# Altium schematic sheet 10.SchDoc
size 513 x 386 mm
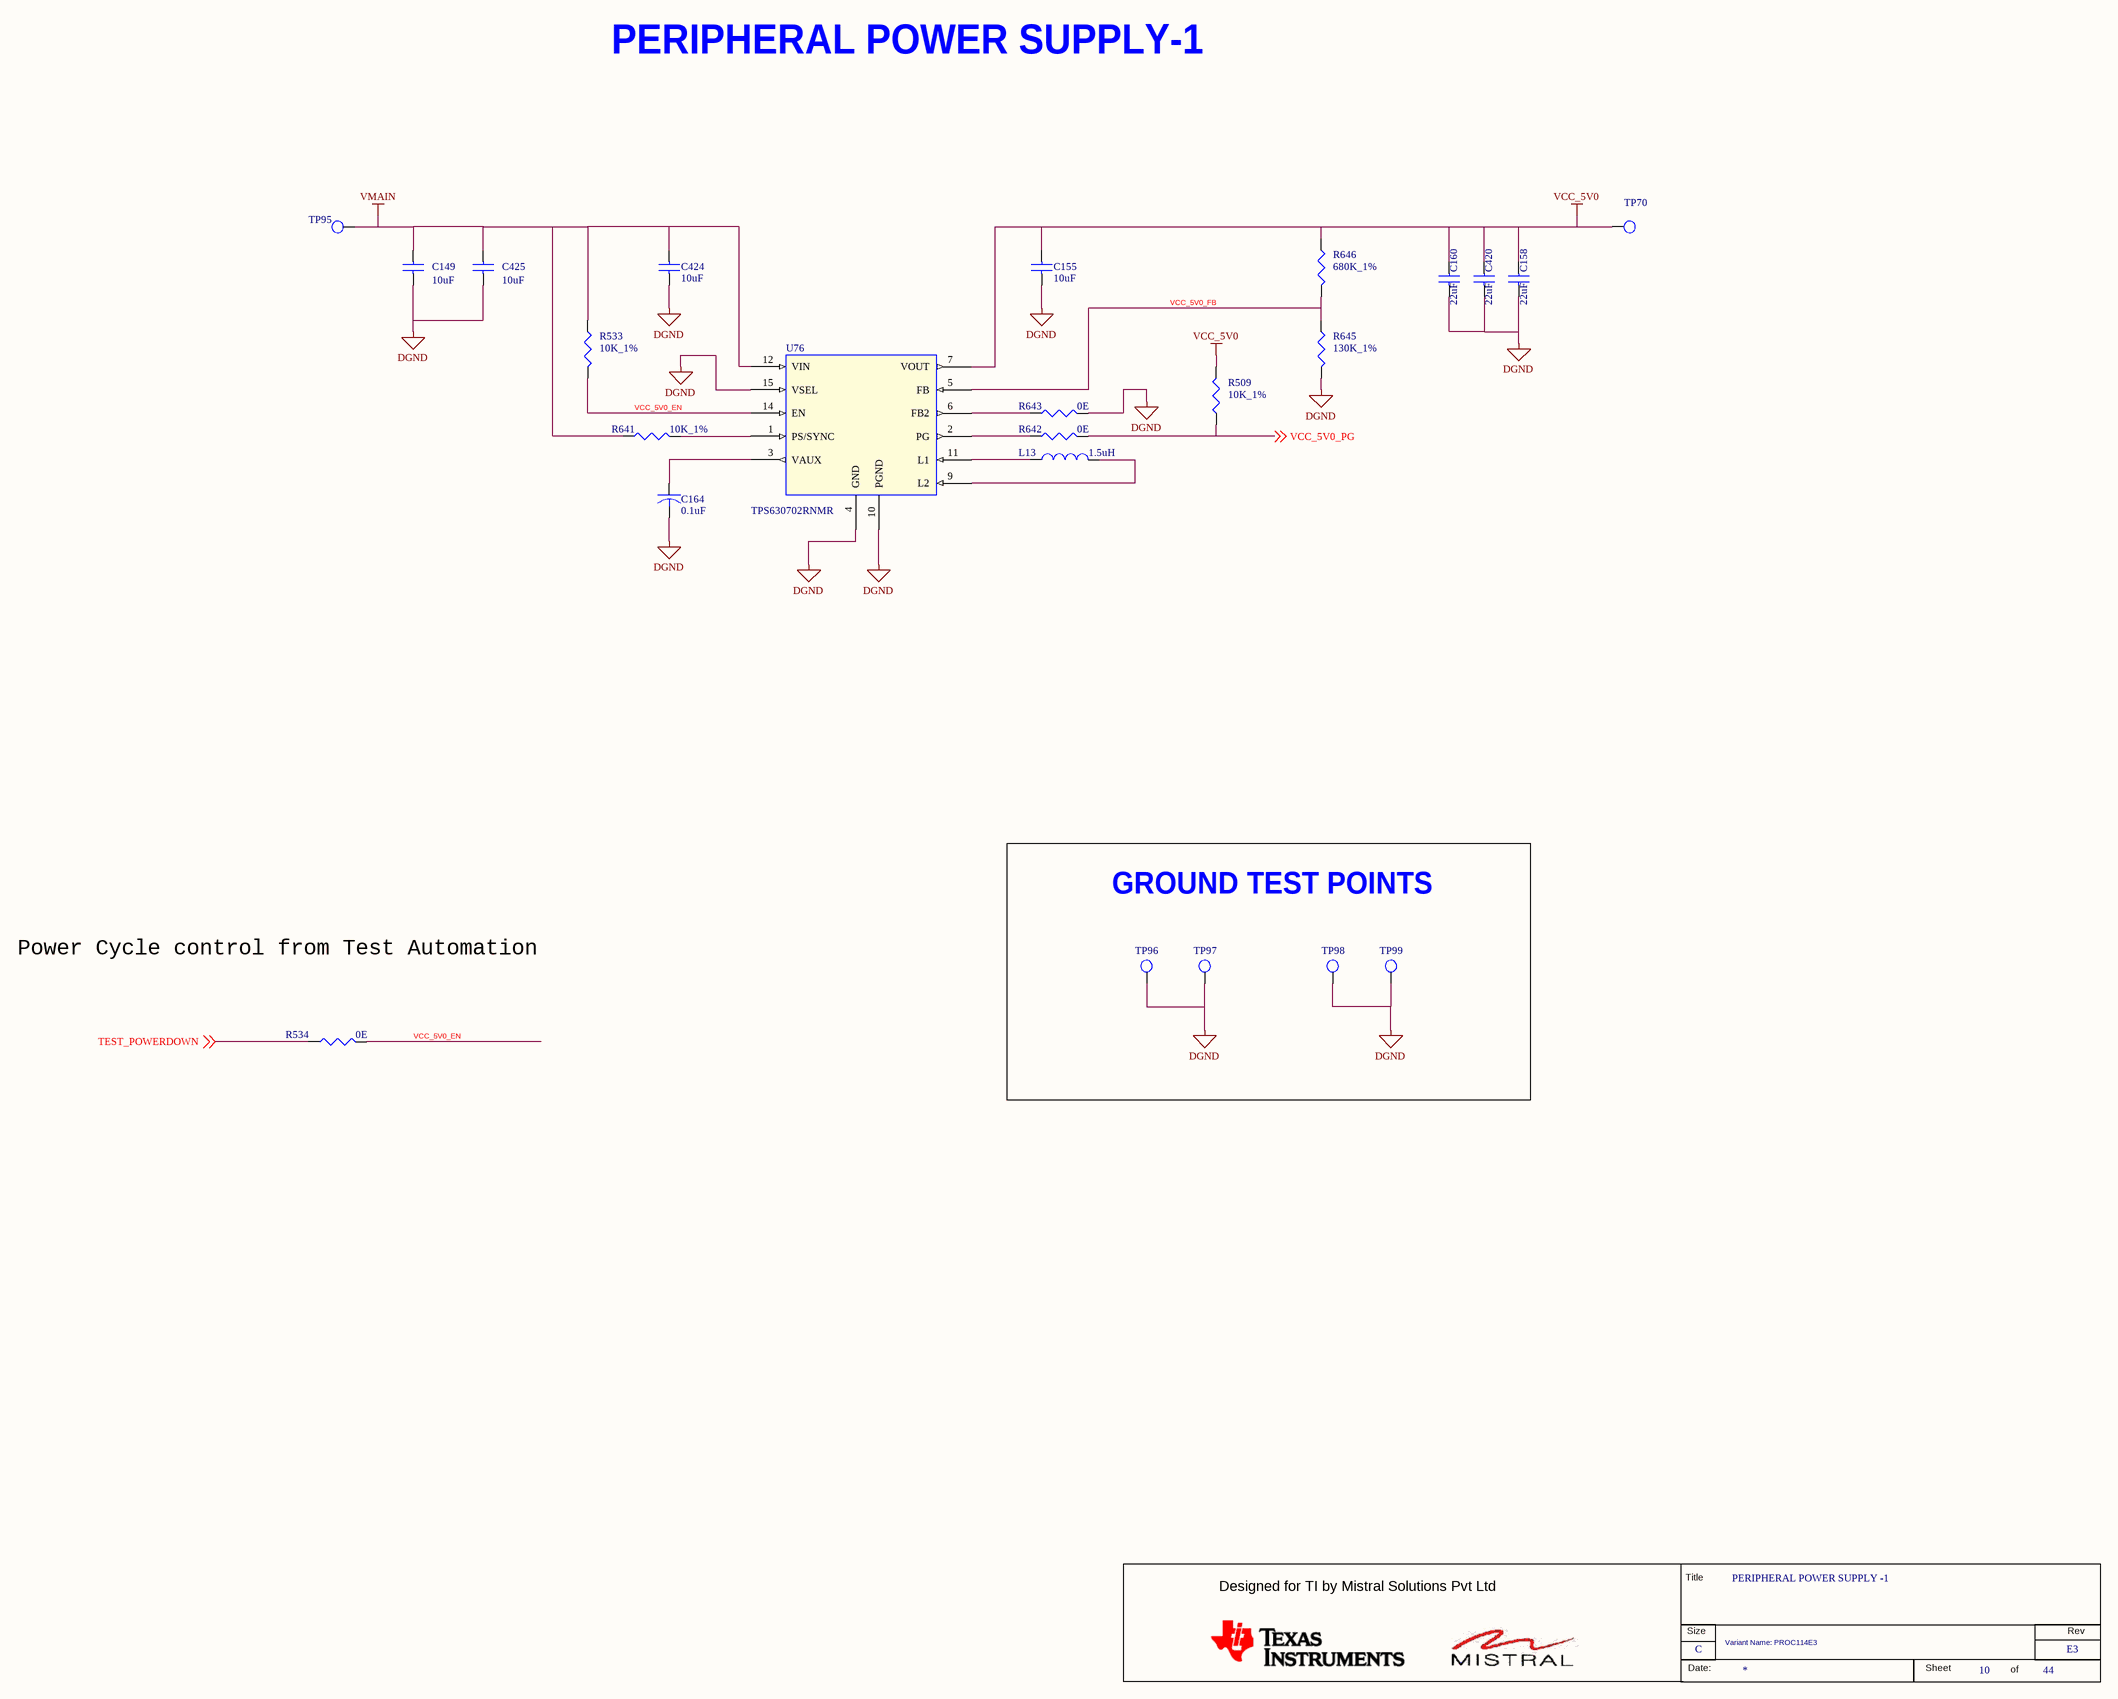
[diagram p0: 10.SchDoc]

## Parts
*  RevCode: E3  Title: PERIPHERAL POWER SUPPLY -1  Page Size: C  Page Number: 10  Page Count: 44  Variant Name: PROC114E3  (hidden comment: MISTRAL_TITLEBLK_CSIZE)  (graphical)
C149  10uF  [CAP0805_1-5]
C155  10uF  [CAP0603_1]
C158  22uF  [CAP0805_1-5]
C160  22uF  [CAP0805_1-5]
C164  0.1uF  [CAP0402_0-75]
C420  22uF  [CAP0805_1-5]
C424  10uF  [CAP0603_1]
C425  10uF  [CAP0805_1-5]
L13  1.5uH  [IND_XFL4020_170X170_SMD_2-1]
R509  10K_1%  [RES0201_0-5]
R533  10K_1%  [RES0201_0-5]
R534  0E  [RES0201_0-5]
R641  10K_1%  [RES0201_0-5]
R642  0E  [RES0201_0-5]
R643  0E  [RES0201_0-5]
R645  130K_1%  [RES0402_0-5]
R646  680K_1%  [RES0402_0-5]
TP70  TP20_SMD  [TP20_SMD]  (value not drawn)
TP95  TP20_SMD  [TP20_SMD]  (value not drawn)
TP96  THRU HOLE  [TP_36X22]  (value not drawn)
TP97  THRU HOLE  [TP_36X22]  (value not drawn)
TP98  TP20_SMD  [TP20_SMD]  (value not drawn)
TP99  TP20_SMD  [TP20_SMD]  (value not drawn)
U76  TPS630702RNMR  [VQFNHR15_TPS630701_100X120_1]

## Blocks framed on the sheet
GROUND TEST POINTS: TP96-TP99

## Nets
DGND: C149.2 C155.2 C158.2 C160.2 C164.2 C420.2 C424.2 C425.2 R643.2 R645.2 TP96.1(TP) TP97.1(TP) TP98.1(TP) TP99.1(TP) U76.4(GND) U76.10(PGND) U76.15(VSEL)
VCC_5V0: C155.1 C158.1 C160.1 C420.1 R509.2 R646.1 TP70.1(TP) U76.7(VOUT)
VMAIN: C149.1 C424.1 C425.1 R533.1 R641.1 TP95.1(TP) U76.12(VIN)
TEST_POWERDOWN: R534.1 ; off-sheet TEST_POWERDOWN
VCC_5V0_EN: R533.2 R534.2 U76.14(EN)
VCC_5V0_FB: R645.1 R646.2 U76.5(FB)
VCC_5V0_PG: R509.1 R642.2 ; off-sheet VCC_5V0_PG
NetC164_1: C164.1 U76.3(VAUX)
NetL13_1: L13.1 U76.11(L1)
NetL13_2: L13.2 U76.9(L2)
NetR641_2: R641.2 U76.1(PS/SYNC)
NetR642_1: R642.1 U76.2(PG)
NetR643_1: R643.1 U76.6(FB2)

## Notes on the sheet
- PERIPHERAL POWER SUPPLY-1
- Power Cycle control from Test Automation
- (in symbol MISTRAL_TITLEBLK_CSIZE) Title; Designed for TI by Mistral Solutions Pvt Ltd; Size; Rev; Date:; Sheet; of

## Library data of the parts
* = MISTRAL_TITLEBLK_CSIZE: Issue: 1.0; Page Create Date: March  8, 1995; Page Modify Date: *; Schematic Page Count: 44; Schematic Page Number: 10
C149 = CAP_Dup2: CAP CERAMIC 10uF 50V 10% X5R 0805; Mistral Part No: 120021030002-R; Mfr_name: MURATA; Mfr_part_number: GRM21BR61H106KE43L; Part_type: CAPACITORS\CERAMIC; Project: J7ES_SK_BRD; Wattage: NA; Customs_HS_Code: 85322990; Custom_Duty: 15%; Footprint Ref: CAP0805_1-5; Tolerance: 10%; Voltage: 50V; Package: 0805; Distributor_name: DIGIKEY; Distributor_part_number: 490-18663-1-ND; Library Ref: CAP; Height: 1.45MM; Weight: 6.4mg; Temperature: -55°C+85°C; Datasheet: Y:\MIS_DATABASE\DATASHEETS\CAPACITORS\GRM21BR61H106KE43.PDF; Crtd /date: ALVY/010321; Chkd/date: MANIRAJA/010321; MECHANICAL 3D STEP FILE: CAP0805_1-5; Library Path: Y:\MIS_DATABASE\Library\ALTIUM_TOOL\SCHEMATICS_PARTS\MS_DISCRETE_Library.schlib; Footprint Path: Y:\MIS_DATABASE\Library\ALTIUM_TOOL\PCB_FOOTPRINTS\Altium_Footprint_Lib.PcbLib; PCB Footprint: CAP0805_1-5
C155 = CAP_Dup2: CAP CERAMIC 10uF 35V 20% X5R 0603; Mistral Part No: 120019050016-R; Mfr_name: MURATA; Mfr_part_number: GRM188R6YA106MA73D; Part_type: CAPACITORS\CERAMIC; Project: BRUKER_SD820_COMMONDO; Wattage: NA; Customs_HS_Code: 85322990; Custom_Duty: 15%; Footprint Ref: CAP0603_1; Tolerance: 20%; Voltage: 35V; Package: 0603; Distributor_name: DIGIKEY; Distributor_part_number: 490-13248-1-ND; Library Ref: CAP; Height: 1.00MM; Weight: 9mg; Temperature: -55°C+85°C; Datasheet: Y:\MIS_DATABASE\DATASHEETS\CAPACITORS\GRM188R6YA106MA73.PDF; Crtd /date: ALVY/160519; Chkd/date: MANIRAJA/170519; MECHANICAL 3D STEP FILE: CAP0603_1; Library Path: Y:\MIS_DATABASE\Library\ALTIUM_TOOL\SCHEMATICS_PARTS\MS_DISCRETE_Library.schlib; Footprint Path: Y:\MIS_DATABASE\Library\ALTIUM_TOOL\PCB_FOOTPRINTS\Altium_Footprint_Lib.PcbLib; PCB Footprint: CAP0603_1
C158 C160 = CAP_Dup2: CAP CERAMIC 22uF 25V 20% X5R 0805; Part_type: CAPACITORS\CERAMIC; Mfr_part_number: GRM21BR61E226ME44K; Mfr_name: MURATA; Mistral Part No: 120013120018-R; Custom_Duty: 15%; Customs_HS_Code: 85322990; Wattage: NA; Project: TI_J7SVB_PCIE_ADD-ON-CARD; PCB Footprint: CAP0805_1-5; Footprint Path: Y:\MIS_DATABASE\Library\ALTIUM_TOOL\PCB_FOOTPRINTS\Altium_Footprint_Lib.PcbLib; Library Path: Y:\MIS_DATABASE\Library\ALTIUM_TOOL\SCHEMATICS_PARTS\MS_DISCRETE_Library.schlib; MECHANICAL 3D STEP FILE: CAP0805_1-5; Chkd/date: MANIRAJA/110718; Crtd /date: ALVY/110718; Datasheet: Y:\MIS_DATABASE\DATASHEETS\CAPACITORS\GRM21BR61E226ME44K.PDF; Temperature: -55°C+85°C; Weight: 9.5mg; Height: 1.45MM; Library Ref: CAP; Distributor_part_number: 490-14661-1-ND; Distributor_name: DIGIKEY; Package: 0805; Voltage: 25V; Tolerance: 20%; Footprint Ref: CAP0805_1-5
C164 = CAP_Dup1: CAP CERAMIC 0.1uF 50V 10% X7R 0402; Part_type: CAPACITORS\CERAMIC; Mfr_part_number: GRM155R71H104KE14D; Mfr_name: MURATA; Mistral Part No: 120011100014-R; Custom_Duty: 15%; Customs_HS_Code: 85322990; Wattage: NA; Project: J7_CP; Footprint Path: Y:\MIS_DATABASE\Library\ALTIUM_TOOL\PCB_FOOTPRINTS\Altium_Footprint_Lib.PcbLib; Library Path: Y:\MIS_DATABASE\Library\ALTIUM_TOOL\SCHEMATICS_PARTS\MS_DISCRETE_Library.schlib; MECHANICAL 3D STEP FILE: CAP0402_0-75; Chkd/date: MANIRAJA/261020; Crtd /date: ALVY/211020; Datasheet: Y:\MIS_DATABASE\DATASHEETS\CAPACITORS\GRM155R71H104KE14.PDF; Temperature: -55°C+125°C; Weight: 3.1mg; Height: 0.55MM; Library Ref: CAP; Distributor_part_number: 490-10700-1-ND; Distributor_name: DIGIKEY; Package: 0402; Voltage: 50V; Tolerance: 10%; Footprint Ref: CAP0402_0-75; PCB Footprint: CAP0402_0-75
C420 = CAP_Dup2: CAP CERAMIC 22uF 25V 20% X5R 0805; Mistral Part No: 120013120018-R; Mfr_name: MURATA; Mfr_part_number: GRM21BR61E226ME44K; Part_type: CAPACITORS\CERAMIC; Project: TI_J7SVB_PCIE_ADD-ON-CARD; Wattage: NA; Customs_HS_Code: 85322990; Custom_Duty: 15%; PCB Footprint: CAP0805_1-5; Footprint Ref: CAP0805_1-5; Tolerance: 20%; Voltage: 25V; Package: 0805; Distributor_name: DIGIKEY; Distributor_part_number: 490-14661-1-ND; Library Ref: CAP; Height: 1.45MM; Weight: 9.5mg; Temperature: -55°C+85°C; Datasheet: Y:\MIS_DATABASE\DATASHEETS\CAPACITORS\GRM21BR61E226ME44K.PDF; Crtd /date: ALVY/110718; Chkd/date: MANIRAJA/110718; MECHANICAL 3D STEP FILE: CAP0805_1-5; Library Path: Y:\MIS_DATABASE\Library\ALTIUM_TOOL\SCHEMATICS_PARTS\MS_DISCRETE_Library.schlib; Footprint Path: Y:\MIS_DATABASE\Library\ALTIUM_TOOL\PCB_FOOTPRINTS\Altium_Footprint_Lib.PcbLib
C424 = CAP_Dup2: CAP CERAMIC 10uF 35V 20% X5R 0603; Part_type: CAPACITORS\CERAMIC; Mfr_part_number: GRM188R6YA106MA73D; Mfr_name: MURATA; Mistral Part No: 120019050016-R; Custom_Duty: 15%; Customs_HS_Code: 85322990; Wattage: NA; Project: BRUKER_SD820_COMMONDO; Footprint Path: Y:\MIS_DATABASE\Library\ALTIUM_TOOL\PCB_FOOTPRINTS\Altium_Footprint_Lib.PcbLib; Library Path: Y:\MIS_DATABASE\Library\ALTIUM_TOOL\SCHEMATICS_PARTS\MS_DISCRETE_Library.schlib; MECHANICAL 3D STEP FILE: CAP0603_1; Chkd/date: MANIRAJA/170519; Crtd /date: ALVY/160519; Datasheet: Y:\MIS_DATABASE\DATASHEETS\CAPACITORS\GRM188R6YA106MA73.PDF; Temperature: -55°C+85°C; Weight: 9mg; Height: 1.00MM; Library Ref: CAP; Distributor_part_number: 490-13248-1-ND; Distributor_name: DIGIKEY; Package: 0603; Voltage: 35V; Tolerance: 20%; Footprint Ref: CAP0603_1; PCB Footprint: CAP0603_1
C425 = CAP_Dup2: CAP CERAMIC 10uF 50V 10% X5R 0805; Part_type: CAPACITORS\CERAMIC; Mfr_part_number: GRM21BR61H106KE43L; Mfr_name: MURATA; Mistral Part No: 120021030002-R; Custom_Duty: 15%; Customs_HS_Code: 85322990; Wattage: NA; Project: J7ES_SK_BRD; Footprint Path: Y:\MIS_DATABASE\Library\ALTIUM_TOOL\PCB_FOOTPRINTS\Altium_Footprint_Lib.PcbLib; Library Path: Y:\MIS_DATABASE\Library\ALTIUM_TOOL\SCHEMATICS_PARTS\MS_DISCRETE_Library.schlib; MECHANICAL 3D STEP FILE: CAP0805_1-5; Chkd/date: MANIRAJA/010321; Crtd /date: ALVY/010321; Datasheet: Y:\MIS_DATABASE\DATASHEETS\CAPACITORS\GRM21BR61H106KE43.PDF; Temperature: -55°C+85°C; Weight: 6.4mg; Height: 1.45MM; Library Ref: CAP; Distributor_part_number: 490-18663-1-ND; Distributor_name: DIGIKEY; Package: 0805; Voltage: 50V; Tolerance: 10%; Footprint Ref: CAP0805_1-5; PCB Footprint: CAP0805_1-5
L13 = INDUCTOR_Dup1: IND POWER 1.5uH 9.1A 20% SMD; Mistral Part No: 130019100011-R; Mfr_name: COIL CRAFT; Mfr_part_number: XFL4020-152MEB; Project: NPOL_UAIS_CONTROLLER-CARD; Voltage: NA; Customs_HS_Code: 85437099; Custom_Duty: 24%; Footprint Ref: IND_XFL4020_170X170_SMD_2-1; Part_type: INDUCTOR; Tolerance: 20%; Wattage: NA; Package: SMD; Distributor_name: MOUSER; Distributor_part_number: 994-XFL4020-152MEB; Library Ref: INDUCTOR; Height: 2.10MM; Weight: 169mg; Temperature: -40°C+125°C; Datasheet: Y:\MIS_DATABASE\DATASHEETS\DISCRETES\INDUCTORS\XFL4020.PDF; Crtd /date: MANIRAJA/101019; Chkd/date: MANIRAJA/101019; MECHANICAL 3D STEP FILE: IND_XFL4020_170X170_SMD_2-1; Library Path: Y:\MIS_DATABASE\Library\ALTIUM_TOOL\SCHEMATICS_PARTS\MS_DISCRETE_Library.schlib; Footprint Path: Y:\MIS_DATABASE\Library\ALTIUM_TOOL\PCB_FOOTPRINTS\Altium_Footprint_Lib.PcbLib; PCB Footprint: IND_XFL4020_170X170_SMD_2-1
R509 R533 R641 = RESISTOR_Dup6: RES 10K 1/20W 1% 0201; Mistral Part No: 110011040018-R; Mfr_name: YAGEO AMERICA; Mfr_part_number: RC0201FR-0710KL; Part_type: RESISTORS\FIXED; Project: GOLDEN-I LITE; Voltage: NA; Customs_HS_Code: 85332119; Custom_Duty: 15%; PCB Footprint: RES0201_0-5; Footprint Ref: RES0201_0-5; Tolerance: 1%; Wattage: 1/20W; Package: 0201; Distributor_name: DIGIKEY; Distributor_part_number: 311-10.0KMCT-ND; Library Ref: RESISTOR; Height: 0.26MM; Weight: 0.17mg; Temperature: -55°C+125°C; Datasheet: Y:\MIS_DATABASE\DATASHEETS\RESISTORS\RCXXXXL-SER_MAR18.PDF; Crtd /date: MANIRAJA/270117; Chkd/date: VASANTHA/270117; MECHANICAL 3D STEP FILE: RES0201_0-5; Library Path: Y:\MIS_DATABASE\Library\ALTIUM_TOOL\SCHEMATICS_PARTS\MS_DISCRETE_Library.schlib; Footprint Path: Y:\MIS_DATABASE\Library\ALTIUM_TOOL\PCB_FOOTPRINTS\Altium_Footprint_Lib.PcbLib
R534 R642 = RESISTOR_Dup6: RES 0E 1/20W 5% 0201; Part_type: RESISTORS\FIXED; Mfr_part_number: RC0201JR-070RL; Mfr_name: YAGEO AMERICA; Mistral Part No: 110010070067-R; Custom_Duty: 15%; Customs_HS_Code: 85332119; Voltage: NA; Project: PB_BUGBASE; PCB Footprint: RES0201_0-5; Footprint Path: Y:\MIS_DATABASE\Library\ALTIUM_TOOL\PCB_FOOTPRINTS\Altium_Footprint_Lib.PcbLib; Library Path: Y:\MIS_DATABASE\Library\ALTIUM_TOOL\SCHEMATICS_PARTS\MS_DISCRETE_Library.schlib; MECHANICAL 3D STEP FILE: RES0201_0-5; Chkd/date: NAVEED/301214; Crtd /date: MUDDU/120710; Datasheet: Y:\MIS_DATABASE\DATASHEETS\RESISTORS\RCXXXXL-SER_MAR18.PDF; Temperature: -55°C+125°C; Weight: 0.17mg; Height: 0.26MM; Library Ref: RESISTOR; Distributor_part_number: 311-0.0NCT-ND; Distributor_name: DIGIKEY; Package: 0201; Wattage: 1/20W; Tolerance: 5%; Footprint Ref: RES0201_0-5
R643 = RESISTOR_Dup6: RES 0E 1/20W 5% 0201; Mistral Part No: 110010070067-R; Mfr_name: YAGEO AMERICA; Mfr_part_number: RC0201JR-070RL; Part_type: RESISTORS\FIXED; Project: PB_BUGBASE; Voltage: NA; Customs_HS_Code: 85332119; Custom_Duty: 15%; PCB Footprint: RES0201_0-5; Footprint Ref: RES0201_0-5; Tolerance: 5%; Wattage: 1/20W; Package: 0201; Distributor_name: DIGIKEY; Distributor_part_number: 311-0.0NCT-ND; Library Ref: RESISTOR; Height: 0.26MM; Weight: 0.17mg; Temperature: -55°C+125°C; Datasheet: Y:\MIS_DATABASE\DATASHEETS\RESISTORS\RCXXXXL-SER_MAR18.PDF; Crtd /date: MUDDU/120710; Chkd/date: NAVEED/301214; MECHANICAL 3D STEP FILE: RES0201_0-5; Library Path: Y:\MIS_DATABASE\Library\ALTIUM_TOOL\SCHEMATICS_PARTS\MS_DISCRETE_Library.schlib; Footprint Path: Y:\MIS_DATABASE\Library\ALTIUM_TOOL\PCB_FOOTPRINTS\Altium_Footprint_Lib.PcbLib
R645 = RESISTOR_Dup6: RES 130K 1/10W 1% 0402; Part_type: RESISTORS\FIXED; Mfr_part_number: ERJ-2RKF1303X; Mfr_name: PANASONIC-ECG; Mistral Part No: 110011060012-R; Custom_Duty: 15%; Customs_HS_Code: 85332119; Voltage: NA; Project: AM4515_EVM_LCD; PCB Footprint: RES0402_0-5; Footprint Path: Y:\MIS_DATABASE\Library\ALTIUM_TOOL\PCB_FOOTPRINTS\Altium_Footprint_Lib.PcbLib; Library Path: Y:\MIS_DATABASE\Library\ALTIUM_TOOL\SCHEMATICS_PARTS\MS_DISCRETE_Library.schlib; MECHANICAL 3D STEP FILE: RES0402_0-5; Chkd/date: MAZHAR/150611; Crtd /date: BAVISH/020611; Datasheet: Y:\MIS_DATABASE\DATASHEETS\RESISTORS\PAN-ERJSER_NOV17.PDF; Temperature: -55°C+155°C; Weight: 0.8mg; Height: 0.40MM; Library Ref: RESISTOR; Distributor_part_number: P130KLCT-ND; Distributor_name: DIGIKEY; Package: 0402; Wattage: 1/10W; Tolerance: 1%; Footprint Ref: RES0402_0-5
R646 = RESISTOR_Dup6: RES 680K 1/10W 1% 0402; Mistral Part No: 110011040004-R; Mfr_name: PANASONIC-ECG; Mfr_part_number: ERJ-2RKF6803X; Part_type: RESISTORS\FIXED; Project: AM4515_EVM_LCD; Voltage: NA; Customs_HS_Code: 85332119; Custom_Duty: 15%; PCB Footprint: RES0402_0-5; Footprint Ref: RES0402_0-5; Tolerance: 1%; Wattage: 1/10W; Package: 0402; Distributor_name: DIGIKEY; Distributor_part_number: P680KLCT-ND; Library Ref: RESISTOR; Height: 0.40MM; Weight: 0.8mg; Temperature: -55°C+155°C; Datasheet: Y:\MIS_DATABASE\DATASHEETS\RESISTORS\PAN-ERJSER_NOV17.PDF; Crtd /date: MAZHAR/180411; Chkd/date: SUHAS/200411; MECHANICAL 3D STEP FILE: RES0402_0-5; Library Path: Y:\MIS_DATABASE\Library\ALTIUM_TOOL\SCHEMATICS_PARTS\MS_DISCRETE_Library.schlib; Footprint Path: Y:\MIS_DATABASE\Library\ALTIUM_TOOL\PCB_FOOTPRINTS\Altium_Footprint_Lib.PcbLib
TP70 TP99 = TESTPOINT: TESTPOINT CIR 20 SMD; Mfr_name: LOCAL; Custom_Duty: NA; Project: BT MODULE_CSRBC04; PCB Footprint: TP20_SMD; Customs_HS_Code: NA; RoHS: NA; Footprint Ref: TP20_SMD; Library Ref: TESTPOINT; Mistral Part No: NA; Mfr_part_number: TP20_SMD; Part_type: TESTPOINT; Package: SMD; Distributor_name: NA; Distributor_part_number: NA; Height: NA; Crtd /date: MAZHAR/171006; Chkd/date: SHREESHAIL/171006; Tolerance: NA; Voltage: NA; Wattage: NA; Weight: NA; Temperature: NA; Datasheet: NA; MECHANICAL 3D STEP FILE: NA; Library Path: Y:\MIS_DATABASE\Library\ALTIUM_TOOL\SCHEMATICS_PARTS\MS_DISCRETE_Library.schlib; Footprint Path: Y:\MIS_DATABASE\Library\ALTIUM_TOOL\PCB_FOOTPRINTS\Altium_Footprint_Lib.PcbLib
TP95 = TESTPOINT: TESTPOINT CIR 20 SMD; Mfr_name: LOCAL; MECHANICAL 3D STEP FILE: NA; Project: BT MODULE_CSRBC04; Footprint Path: Y:\MIS_DATABASE\Library\ALTIUM_TOOL\PCB_FOOTPRINTS\Altium_Footprint_Lib.PcbLib; Library Path: Y:\MIS_DATABASE\Library\ALTIUM_TOOL\SCHEMATICS_PARTS\MS_DISCRETE_Library.schlib; Datasheet: NA; Temperature: NA; Weight: NA; Wattage: NA; Voltage: NA; Tolerance: NA; Chkd/date: SHREESHAIL/171006; Crtd /date: MAZHAR/171006; Height: NA; Distributor_part_number: NA; Distributor_name: NA; Package: SMD; Part_type: TESTPOINT; Mfr_part_number: TP20_SMD; Mistral Part No: NA; Library Ref: TESTPOINT; Footprint Ref: TP20_SMD; RoHS: NA; Customs_HS_Code: NA; Custom_Duty: NA; PCB Footprint: TP20_SMD
TP96 = TESTPOINT: TESTPOINT 0.56MM DRILL PTH; Mfr_name: LOCAL; Mistral Part No: 130010010008; Project: KOPIN_MODULS; Tolerance: NA; PCB Footprint: TP_36X22; Library Ref: TESTPOINT; Datasheet: NA; Chkd/date: BAVISH/040311; Crtd /date: MAZHAR/110405; Height: NA; Distributor_part_number: NA; Distributor_name: NA; Package: THRU-HOLE; Part_type: TESTPOINT; Mfr_part_number: TP_36X22; Voltage: NA; Wattage: NA; Weight: NA; Temperature: NA
TP97 = TESTPOINT: TESTPOINT 0.56MM DRILL PTH; Mistral Part No: 130010010008; Mfr_name: LOCAL; Wattage: NA; Project: KOPIN_MODULS; PCB Footprint: TP_36X22; Temperature: NA; Weight: NA; Voltage: NA; Tolerance: NA; Mfr_part_number: TP_36X22; Part_type: TESTPOINT; Package: THRU-HOLE; Distributor_name: NA; Distributor_part_number: NA; Height: NA; Crtd /date: MAZHAR/110405; Chkd/date: BAVISH/040311; Datasheet: NA; Library Ref: TESTPOINT
TP98 = TESTPOINT: TESTPOINT CIR 20 SMD; Mistral Part No: NA; Mfr_name: LOCAL; Project: BT MODULE_CSRBC04; PCB Footprint: TP20_SMD; RoHS: NA; Footprint Ref: TP20_SMD; Library Ref: TESTPOINT; Mfr_part_number: TP20_SMD; Part_type: TESTPOINT; Package: SMD; Distributor_name: NA; Distributor_part_number: NA; Height: NA; Crtd /date: MAZHAR/171006; Chkd/date: SHREESHAIL/171006; Tolerance: NA; Voltage: NA; Wattage: NA; Weight: NA; Temperature: NA; Datasheet: NA; MECHANICAL 3D STEP FILE: NA; Library Path: Y:\MIS_DATABASE\Library\ALTIUM_TOOL\SCHEMATICS_PARTS\MS_DISCRETE_Library.schlib; Footprint Path: Y:\MIS_DATABASE\Library\ALTIUM_TOOL\PCB_FOOTPRINTS\Altium_Footprint_Lib.PcbLib; Customs_HS_Code: NA; Custom_Duty: NA
U76 = TPS630701_VQFN-HR15: IC ADJ BUCK-BOOST CONVERTER WITH 3.6A SWITCH CURRENT VQFN-HR15; Mistral Part No: 142022010015-R; Mfr_name: TEXAS INSTRUMENTS; Part_type: ICS\POWER\DC-DC CONVERTER; Project: AM62X_SKEVM; Tolerance: NA; Customs_HS_Code: 85423100; Custom_Duty: 15%; PCB Footprint: VQFNHR15_TPS630701_100X120_1; Footprint Ref: VQFNHR15_TPS630701_100X120_1; Mfr_part_number: TPS630702RNMR; Voltage: NA; Wattage: NA; Package: VQFN-HR15; Distributor_name: DIGIKEY; Distributor_part_number: 296-TPS630702RNMRCT-ND; Library Ref: TPS630701_VQFN-HR15; Height: 1.00MM; Weight: 17.7mg; Temperature: -40°C+125°C; Datasheet: Y:\MIS_DATABASE\DATASHEETS\ICS\POWER\TPS630701X.PDF; Crtd /date: MANIRAJA/250122; Chkd/date: ALVY/250122; MECHANICAL 3D STEP FILE: VQFNHR15_TPS630701_100X120_1; Library Path: Y:\MIS_DATABASE\Library\ALTIUM_TOOL\SCHEMATICS_PARTS\MS_MISCPOWER_Library.schlib; Footprint Path: Y:\MIS_DATABASE\Library\ALTIUM_TOOL\PCB_FOOTPRINTS\Altium_Footprint_Lib.PcbLib